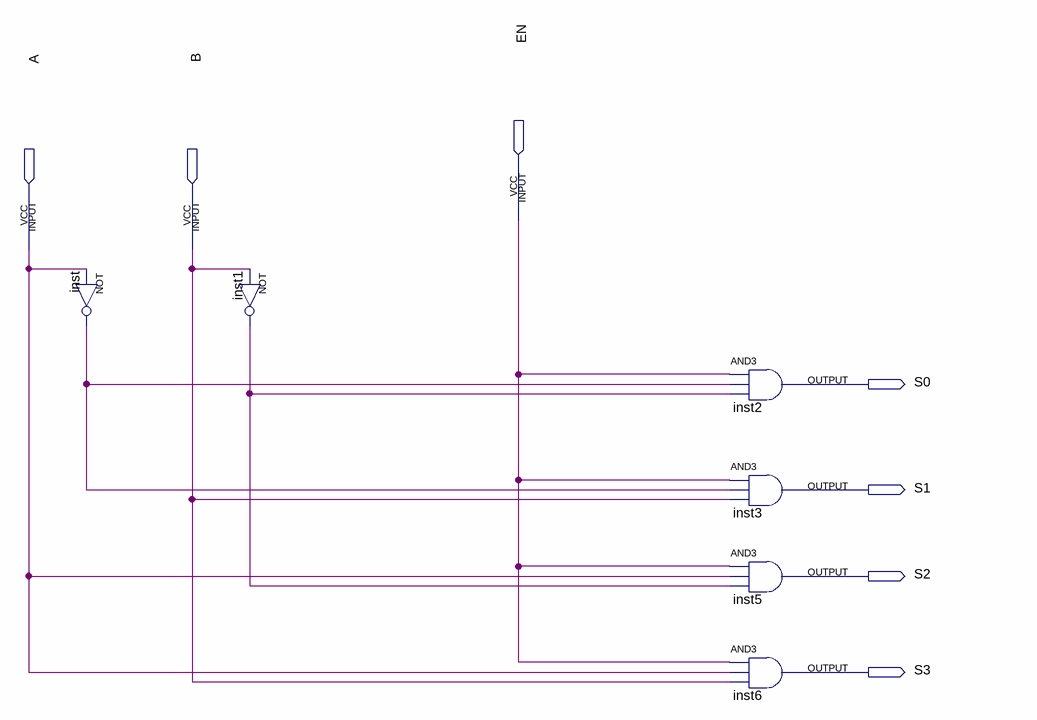
[diagram p0: schematic sheet]
// Quartus schematic DECODER2_4_EN.bdf as structural Verilog: 6 symbols, 7 pins
module DECODER2_4_EN (
  input  EN,
  input  A,
  input  B,
  output S0,
  output S1,
  output S2,
  output S3
);

  wire inst1_out, inst_out;

  not inst (inst_out, A);
  not inst1 (inst1_out, B);
  and inst2 (S0, EN, inst_out, inst1_out);
  and inst3 (S1, EN, inst_out, B);
  and inst5 (S2, EN, A, inst1_out);
  and inst6 (S3, EN, A, B);
endmodule
